# EAGLE schematic RPiHeatingArduinoOilSensorTCP-IO (EAGLE 7.5.0)
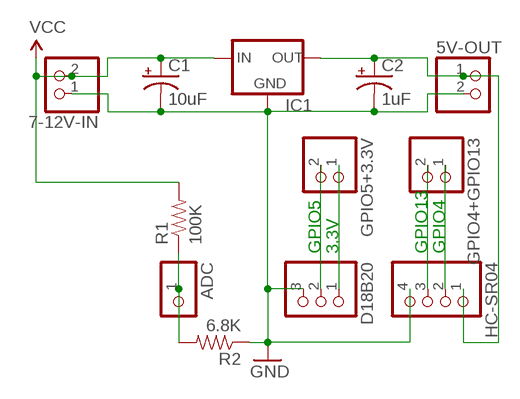
[diagram p0: schematic, sheet 1]

## Parts
5V-OUT  PINHD-1X2  [1X02]
7-12V-IN  PINHD-1X2  [1X02]
ADC  PINHD-1X1  [1X01]
C1  10uF  CAP_POLPTH2  [CPOL-RADIAL-10UF-25V]
C2  1uF  CAP_POLPTH2  [CPOL-RADIAL-10UF-25V]
D18B20  PINHD-1X3  [1X03]
GPIO4+GPIO13  PINHD-1X2  [1X02]
GPIO5+3.3V  PINHD-1X2  [1X02]
HC-SR04  PINHD-1X4  [1X04]
IC1  78XXL  [78XXL]
R1  100K  RESISTORPTH-1/4W  [AXIAL-0.4]
R2  6.8K  RESISTORPTH-1/4W  [AXIAL-0.4]

## Nets
3.3V: D18B20.1 GPIO5+3.3V.1
5V: 5V-OUT.1 C2.1(+) HC-SR04.1 IC1.OUT
7-12V: 7-12V-IN.2 C1.1(+) IC1.IN R1.P$2 ; supply symbol labelled VCC
GND: 5V-OUT.2 7-12V-IN.1 C1.2(-) C2.2(-) D18B20.3 HC-SR04.4 IC1.GND R2.P$1
GPIO4: GPIO4+GPIO13.1 HC-SR04.2
GPIO5: D18B20.2 GPIO5+3.3V.2
GPIO13: GPIO4+GPIO13.2 HC-SR04.3
N$1: ADC.1 R1.P$1 R2.P$2

## Notes on the sheet
- GPIO5 | 3.3V | GPIO13 | GPIO4

## Library data of the parts
5V-OUT 7-12V-IN GPIO4+GPIO13 GPIO5+3.3V = pinhead:PINHD-1X2: PIN HEADER
ADC = pinhead:PINHD-1X1: PIN HEADER
C1 C2 = SparkFun-Capacitors:CAP_POL: Capacitor Polarized These are standard SMD and PTH capacitors. Normally 10uF, 47uF, and 100uF in electrolytic and tantalum varieties. Always verify the external diameter of the through hole cap, it varies with capacity, voltage, and manufacturer. The EIA devices should be standard.
D18B20 = pinhead:PINHD-1X3: PIN HEADER
HC-SR04 = pinhead:PINHD-1X4: PIN HEADER
IC1 = v-reg:78XXL: VOLTAGE REGULATOR
R1 R2 = SparkFun-Resistors:RESISTOR: Resistor Basic schematic elements and footprints for 0603, 1206, and PTH resistors.